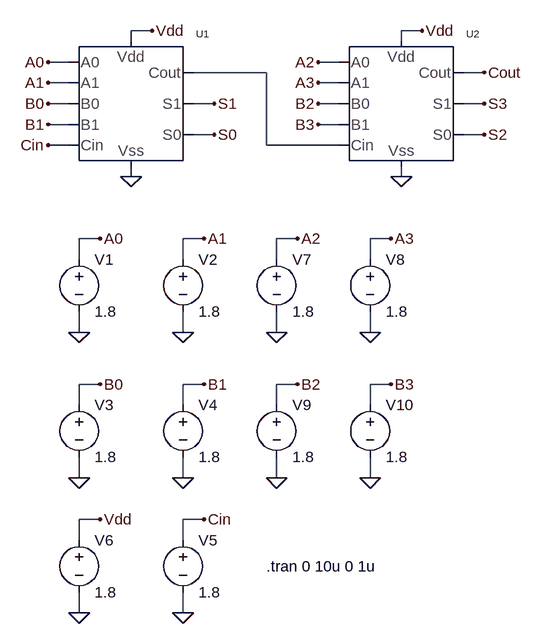
[diagram p0: schematic 4_Bit_CLA.asc]
4_Bit_CLA.asc, the LTspice schematic file:
Version 4
SHEET 1 1404 1092
WIRE 240 48 208 48
WIRE 656 48 624 48
WIRE 208 64 208 48
WIRE 624 64 624 48
WIRE 112 96 80 96
WIRE 528 96 496 96
WIRE 416 112 304 112
WIRE 752 112 720 112
WIRE 112 128 80 128
WIRE 528 128 496 128
WIRE 112 160 80 160
WIRE 336 160 304 160
WIRE 528 160 496 160
WIRE 752 160 720 160
WIRE 112 192 80 192
WIRE 528 192 496 192
WIRE 336 208 304 208
WIRE 752 208 720 208
WIRE 112 224 80 224
WIRE 416 224 416 112
WIRE 528 224 416 224
WIRE 208 272 208 256
WIRE 624 272 624 256
WIRE 160 368 128 368
WIRE 320 368 288 368
WIRE 464 368 432 368
WIRE 608 368 576 368
WIRE 128 400 128 368
WIRE 288 400 288 368
WIRE 432 400 432 368
WIRE 576 400 576 368
WIRE 128 512 128 480
WIRE 288 512 288 480
WIRE 432 512 432 480
WIRE 576 512 576 480
WIRE 160 592 128 592
WIRE 320 592 288 592
WIRE 464 592 432 592
WIRE 608 592 576 592
WIRE 128 624 128 592
WIRE 288 624 288 592
WIRE 432 624 432 592
WIRE 576 624 576 592
WIRE 128 736 128 704
WIRE 288 736 288 704
WIRE 432 736 432 704
WIRE 576 736 576 704
WIRE 160 800 128 800
WIRE 320 800 288 800
WIRE 128 832 128 800
WIRE 288 832 288 800
WIRE 128 944 128 912
WIRE 288 944 288 912
FLAG 240 48 Vdd
FLAG 656 48 Vdd
FLAG 208 272 0
FLAG 624 272 0
FLAG 80 96 A0
FLAG 80 128 A1
FLAG 80 160 B0
FLAG 80 192 B1
FLAG 80 224 Cin
FLAG 336 160 S1
FLAG 336 208 S0
FLAG 496 96 A2
FLAG 496 128 A3
FLAG 496 160 B2
FLAG 496 192 B3
FLAG 752 160 S3
FLAG 752 208 S2
FLAG 752 112 Cout
FLAG 128 512 0
FLAG 160 368 A0
FLAG 288 512 0
FLAG 320 368 A1
FLAG 128 736 0
FLAG 160 592 B0
FLAG 288 736 0
FLAG 320 592 B1
FLAG 288 944 0
FLAG 320 800 Cin
FLAG 128 944 0
FLAG 160 800 Vdd
FLAG 432 512 0
FLAG 464 368 A2
FLAG 576 512 0
FLAG 608 368 A3
FLAG 432 736 0
FLAG 464 592 B2
FLAG 576 736 0
FLAG 608 592 B3
SYMBOL 2_Bit_CLA 208 160 R0
SYMATTR InstName U1
SYMBOL 2_Bit_CLA 624 160 R0
SYMATTR InstName U2
SYMBOL voltage 128 384 R0
WINDOW 123 0 0 Left 0
WINDOW 39 0 0 Left 0
SYMATTR InstName V1
SYMATTR Value 1.8
SYMBOL voltage 288 384 R0
WINDOW 123 0 0 Left 0
WINDOW 39 0 0 Left 0
SYMATTR InstName V2
SYMATTR Value 1.8
SYMBOL voltage 128 608 R0
WINDOW 123 0 0 Left 0
WINDOW 39 0 0 Left 0
SYMATTR InstName V3
SYMATTR Value 1.8
SYMBOL voltage 288 608 R0
WINDOW 123 0 0 Left 0
WINDOW 39 0 0 Left 0
SYMATTR InstName V4
SYMATTR Value 1.8
SYMBOL voltage 288 816 R0
WINDOW 123 0 0 Left 0
WINDOW 39 0 0 Left 0
SYMATTR InstName V5
SYMATTR Value 1.8
SYMBOL voltage 128 816 R0
WINDOW 123 0 0 Left 0
WINDOW 39 0 0 Left 0
SYMATTR InstName V6
SYMATTR Value 1.8
SYMBOL voltage 432 384 R0
WINDOW 123 0 0 Left 0
WINDOW 39 0 0 Left 0
SYMATTR InstName V7
SYMATTR Value 1.8
SYMBOL voltage 576 384 R0
WINDOW 123 0 0 Left 0
WINDOW 39 0 0 Left 0
SYMATTR InstName V8
SYMATTR Value 1.8
SYMBOL voltage 432 608 R0
WINDOW 123 0 0 Left 0
WINDOW 39 0 0 Left 0
SYMATTR InstName V9
SYMATTR Value 1.8
SYMBOL voltage 576 608 R0
WINDOW 123 0 0 Left 0
WINDOW 39 0 0 Left 0
SYMATTR InstName V10
SYMATTR Value 1.8
TEXT 416 872 Left 2 !.tran 0 10u 0 1u

The netlist it stands for:
* 4_Bit_CLA.asc
XU1 A0 A1 B0 B1 Cin N001 S1 S0 Vdd 0 2_Bit_CLA  ; pins A0 A1 B0 B1 Cin Cout S1 S0 Vdd Vss
XU2 A2 A3 B2 B3 N001 Cout S3 S2 Vdd 0 2_Bit_CLA  ; pins A0 A1 B0 B1 Cin Cout S1 S0 Vdd Vss
V1 A0 0 1.8
V2 A1 0 1.8
V3 B0 0 1.8
V4 B1 0 1.8
V5 Cin 0 1.8
V6 Vdd 0 1.8
V7 A2 0 1.8
V8 A3 0 1.8
V9 B2 0 1.8
V10 B3 0 1.8
.tran 0 10u 0 1u
.lib 2_Bit_CLA.sub
.backanno
.end